# EAGLE design lp (EAGLE 7.5.0)
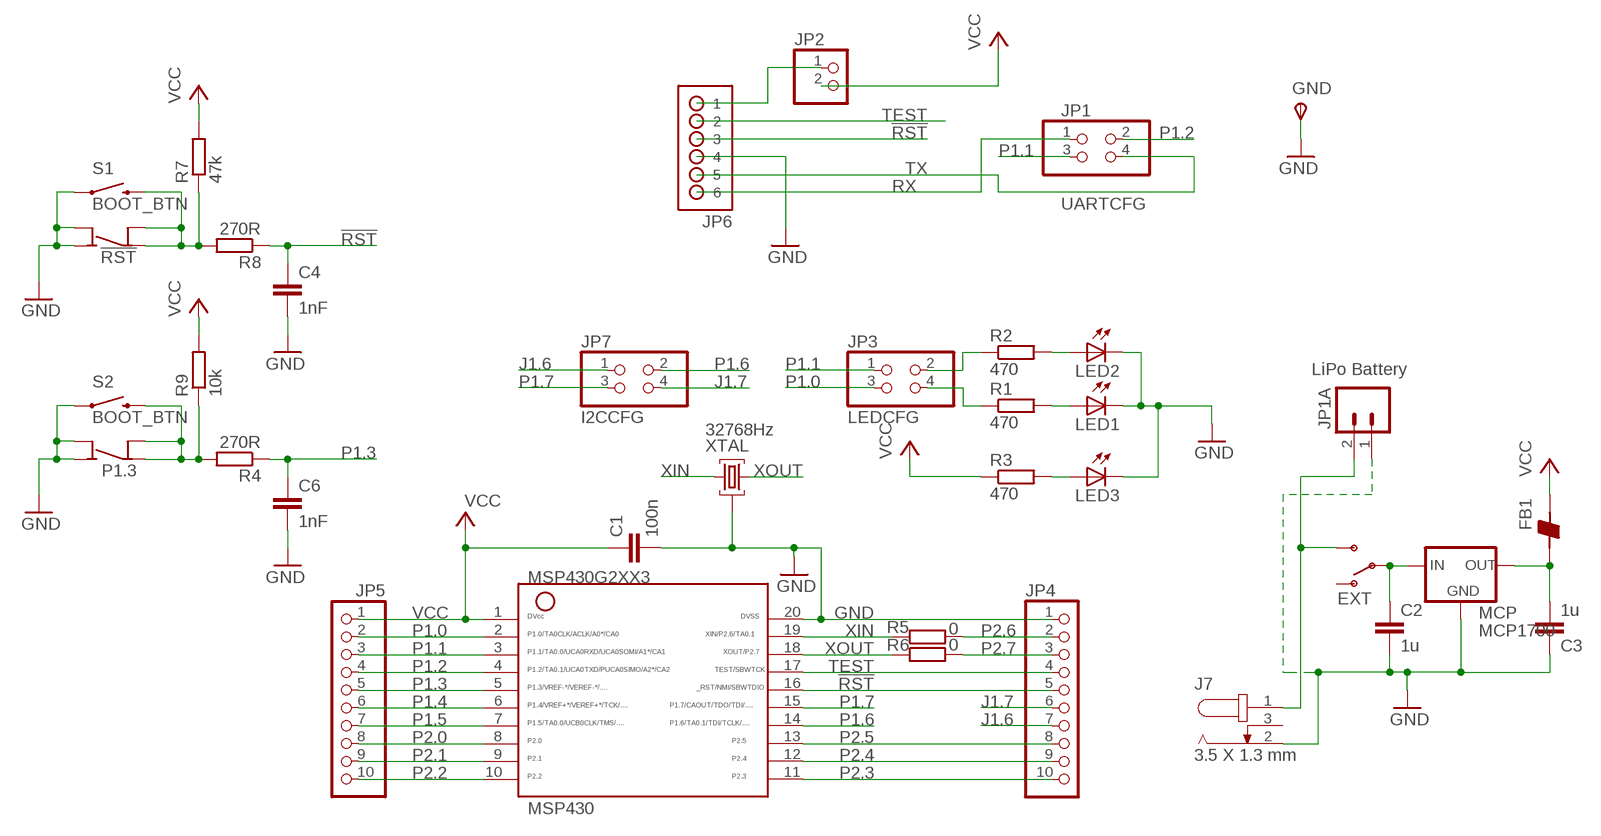
[diagram p0: schematic, sheet 1]

## Parts
!RST  !RST  SPST4  [6MMTACTILE_4PIN]
C1  100n  C-EUC0805  [C0805]
C2  1u  C-EUC0805  [C0805]
C3  1u  C-EUC0805  [C0805]
C4  1nF  C-EUC0805  [C0805]
C6  1nF  C-EUC0805  [C0805]
FB1  BEAD-0805  [0805]
GND  TPSTP20R  [TP20R]
J7  3.5 X 1.3 mm  DC_JACK_3.5X1.3MM  [3.5X1.3MM_DC_JACK]
JP1  UARTCFG  PINHD-2X2  [2X02]
JP1A  LiPo Battery  M02JST-PTH-2  [JST-2-PTH]
JP2  PINHD-1X2  [1X02]
JP3  LEDCFG  PINHD-2X2  [2X02]
JP4  PH1X10OCT076  [PH1X10OCT76]
JP5  PH1X10OCT076  [PH1X10OCT76]
JP6  No Load  HDR-1X6-OFFSET  [HDR-1X6_OFFSET]
JP7  I2CCFG  PINHD-2X2  [2X02]
LED1  0  LEDCHIPLED_1206  [CHIPLED_1206]
LED2  0  LEDCHIPLED_1206  [CHIPLED_1206]
LED3  0  LEDCHIPLED_1206  [CHIPLED_1206]
MCP  MCP1700  MCP1700SOT-23  [SOT-23]
MSP430  MSP430N  G2XX3---N20HEX  [DIP20_HEX]
ON  EXT  SWITCH-SPSTPTH  [SWITCH-SPDT]
P1.3  P1.3  SPST4  [6MMTACTILE_4PIN]
R1  470  R-EU_R0805  [R0805]
R2  470  R-EU_R0805  [R0805]
R3  470  R-EU_R0805  [R0805]
R4  270R  R-EU_R0805  [R0805]
R5  0  R-EU_R0805  [R0805]
R6  0  R-EU_R0805  [R0805]
R7  47k  R-EU_R0805  [R0805]
R8  270R  R-EU_R0805  [R0805]
R9  10k  R-EU_R0805  [R0805]
S1  BOOT_BTN  SWITCH-MOMENTARY-2-SMD-1101NE  [TACTILE-SWITCH-1101NE]
S2  BOOT_BTN  SWITCH-MOMENTARY-2-SMD-1101NE  [TACTILE-SWITCH-1101NE]
XTAL  32768Hz  QUARZ5  [QUARZ5]

## Nets
!RST: C4.1 JP4.5 JP6.3 MSP430.16 R8.1
GND [GND]: !RST.A1(NO) !RST.A2(NO) C1.2 C2.2 C3.1 C4.2 C6.2 GND.TP(PP) J7.2 JP1A.1 JP4.1 JP6.4 LED1.C LED2.C LED3.C MCP.1(GND) MSP430.20 P1.3.A1(NO) P1.3.A2(NO) S1.1 S2.1 XTAL.GND@0
J1.6: JP4.7 JP7.1
J1.7: JP4.6 JP7.4
N$1: JP3.2 R2.1
N$2: JP3.4 R1.1
N$3 [VCC]: C2.1 MCP.3(IN) ON.2(P)
N$4: P1.3.B1(COM) P1.3.B2(COM) R4.2 R9.1 S2.2
N$5: !RST.B1(COM) !RST.B2(COM) R7.1 R8.2 S1.2
N$6 [VCC]: C3.2 FB1.1 MCP.2(OUT)
N$11: LED3.A R3.2
N$13: LED1.A R1.2
N$14: LED2.A R2.2
P1.0: JP3.3 JP5.2 MSP430.2
P1.1: JP1.3 JP3.1 JP5.3 MSP430.3
P1.2: JP1.2 JP5.4 MSP430.4
P1.3: C6.1 JP5.5 MSP430.5 R4.1
P1.4: JP5.6 MSP430.6
P1.5: JP5.7 MSP430.7
P1.6: JP7.2 MSP430.14
P1.7: JP7.3 MSP430.15
P2.0: JP5.8 MSP430.8
P2.1: JP5.9 MSP430.9
P2.2: JP5.10 MSP430.10
P2.3: JP4.10 MSP430.11
P2.4: JP4.9 MSP430.12
P2.5: JP4.8 MSP430.13
P2.6: JP4.2 R5.2
P2.7: JP4.3 R6.2
RX [GND]: JP1.1 JP6.6
TEST: JP4.4 JP6.2 MSP430.17
TX [GND]: JP1.4 JP6.5
VCC [VCC]: C1.1 FB1.2 JP2.2 JP5.1 MSP430.1 R3.1 R7.2 R9.2
VCCEXT [VCC]: J7.1 JP1A.2 ON.3(S)
VCCFET [VCC]: JP2.1 JP6.1
XIN: MSP430.19 R5.1 XTAL.2
XOUT: MSP430.18 R6.1 XTAL.1
Unconnected: J7.3 ON.1(O)

## Library data of the parts
!RST P1.3 = mes_electromech:SPST4: SPST switch with 2 pins per contact
C1-C3 = rcl:C-EU: CAPACITOR, European symbol
C4 C6 = resistor:C-EU: CAPACITOR, European symbol
FB1 = CH_passive:BEAD
GND = testpad:TPS: TEST PIN
J7 = MY_CONN:DC_JACK_3.5X1.3MM
JP1 JP3 JP7 = pinhead:PINHD-2X2: PIN HEADER
JP1A = SparkFun:M02: Header 2 Standard 2-pin 0.1" header. Use with straight break away headers (SKU : PRT-00116), right angle break away headers (PRT-00553), swiss pins (PRT-00743), machine pins (PRT-00117), and female headers (PRT-00115). Molex polarized connector foot print use with SKU : PRT-08233 with associated crimp pins and housings.
JP2 = pinhead:PINHD-1X2: PIN HEADER
JP4 JP5 = MY_CONN:PH1X10
JP6 = Mechanical:HDR-1X6-OFFSET: 42 mil hole pattern with 16mil offset for jtag connector
LED1-LED3 = led:LED: LED OSRAM: - CHIPLED LG R971, LG N971, LY N971, LG Q971, LY Q971, LO R971, LY R971 LH N974, LH R974 LS Q976, LO Q976, LY Q976 LO Q996 - Hyper CHIPLED LW Q18S LB Q993, LB Q99A, LB R99A - SideLED LS A670, LO A670, LY A670, LG A670, LP A670 LB A673, LV A673, LT A673, LW A673 LH A674 LY A675 LS A676, LA A676, LO A676, LY A676, LW A676 LS A679, LY A679, LG A679 - Hyper Micro SIDELED® LS Y876, LA Y876, LO Y876, LY Y876 LT Y87S - SmartLED LW L88C, LW L88S LB L89C, LB L89S, LG L890 LS L89K, LO L89K, LY L89K LS L896, LA L896, LO L896, LY L896 - TOPLED LS T670, LO T670, LY T670, LG T670, LP T670 LSG T670, LSP T670, LSY T670, LOP T670, LYG T670 LG T671, LOG T671, LSG T671 LB T673, LV T673, LT T673, LW T673 LH T674 LS T676, LA T676, LO T676, LY T676, LB T676, LH T676, LSB T676, LW T676 LB T67C, LV T67C, LT T67C, LS T67K, LO T67K, LY T67K, LW E67C LS E67B, LA E67B, LO E67B, LY E67B, LB E67C, LV E67C, LT E67C LW T67C LS T679, LY T679, LG T679 LS T770, LO T770, LY T770, LG T770, LP T770 LB T773, LV T773, LT T773, LW T773 LH T774 LS E675, LA E675, LY E675, LS T675 LS T776, LA T776, LO T776, LY T776, LB T776 LHGB T686 LT T68C, LB T68C - Hyper Mini TOPLED® LB M676 - Mini TOPLED Santana® LG M470 LS M47K, LO M47K, LY M47K Source: http://www.osram.convergy.de LUXEON: - LUMILED® LXK2-PW12-R00, LXK2-PW12-S00, LXK2-PW14-U00, LXK2-PW14-V00 LXK2-PM12-R00, LXK2-PM12-S00, LXK2-PM14-U00 LXK2-PE12-Q00, LXK2-PE12-R00, LXK2-PE12-S00, LXK2-PE14-T00, LXK2-PE14-U00 LXK2-PB12-K00, LXK2-PB12-L00, LXK2-PB12-M00, LXK2-PB14-N00, LXK2-PB14-P00, LXK2-PB14-Q00 LXK2-PR12-L00, LXK2-PR12-M00, LXK2-PR14-Q00, LXK2-PR14-R00 LXK2-PD12-Q00, LXK2-PD12-R00, LXK2-PD12-S00 LXK2-PH12-R00, LXK2-PH12-S00 LXK2-PL12-P00, LXK2-PL12-Q00, LXK2-PL12-R00 Source: www.luxeon.com KINGBRIGHT: KA-3528ASYC Source: www.kingbright.com
MCP = MY_IC:MCP1700
MSP430 = TI_MSP430_v16:G2XX3---N20: MSP430G2XX1 PDIP (N) 20 Pin Package
ON = SparkFun:SWITCH-SPST: SPST Switch Simple slide switch. Spark Fun Electronics SKU : COM-00102
R1-R4 R7-R9 = resistor:R-EU_: RESISTOR, European symbol
R5 R6 = rcl:R-EU_: RESISTOR, European symbol
S1 S2 = SparkFun-Electromechanical:SWITCH-MOMENTARY-2: Various NO switches- pushbuttons, reed, etc
XTAL = my_xtal:QUARZ5

## Net classes
0 default: width 0.406 mm, drill 0.508 mm
1 GND: width 0.508 mm, drill 0.508 mm
2 VCC: width 1.016 mm, drill 0.508 mm
4 VCCEXT: width 0.762 mm, drill 0.508 mm, clearance 0.229 mm

## Board
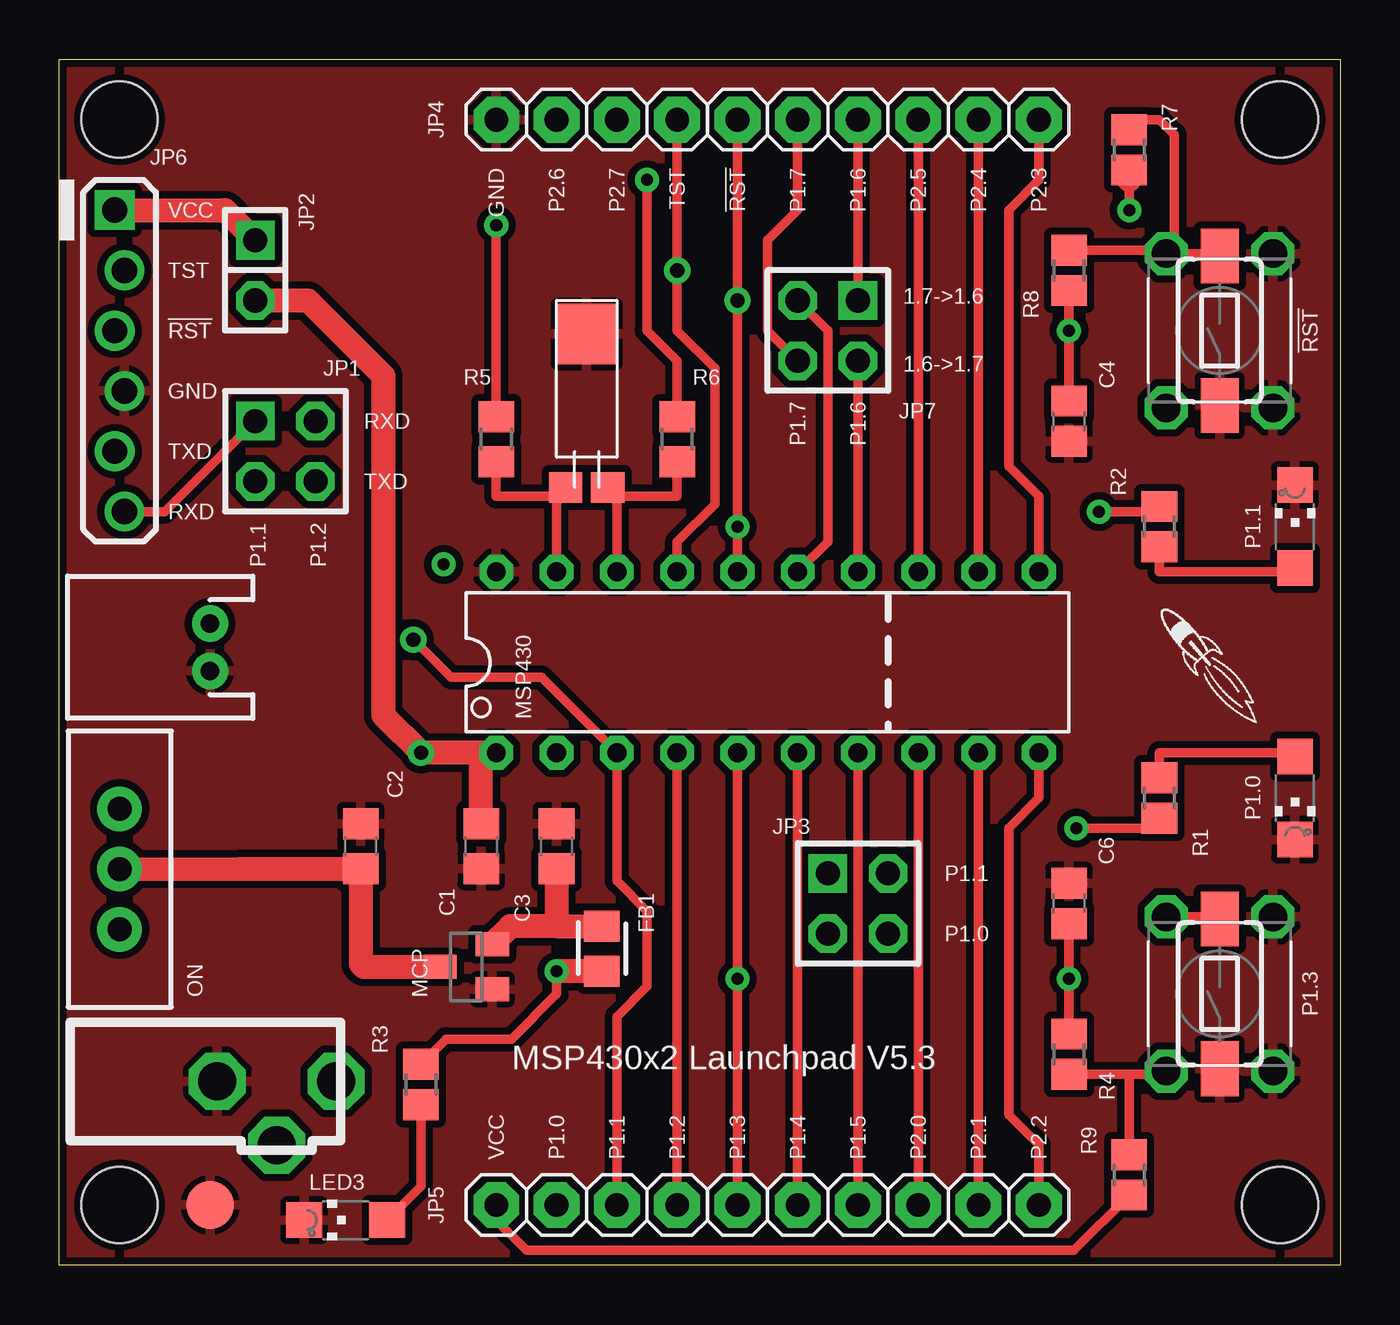
[diagram p1: board, top side]
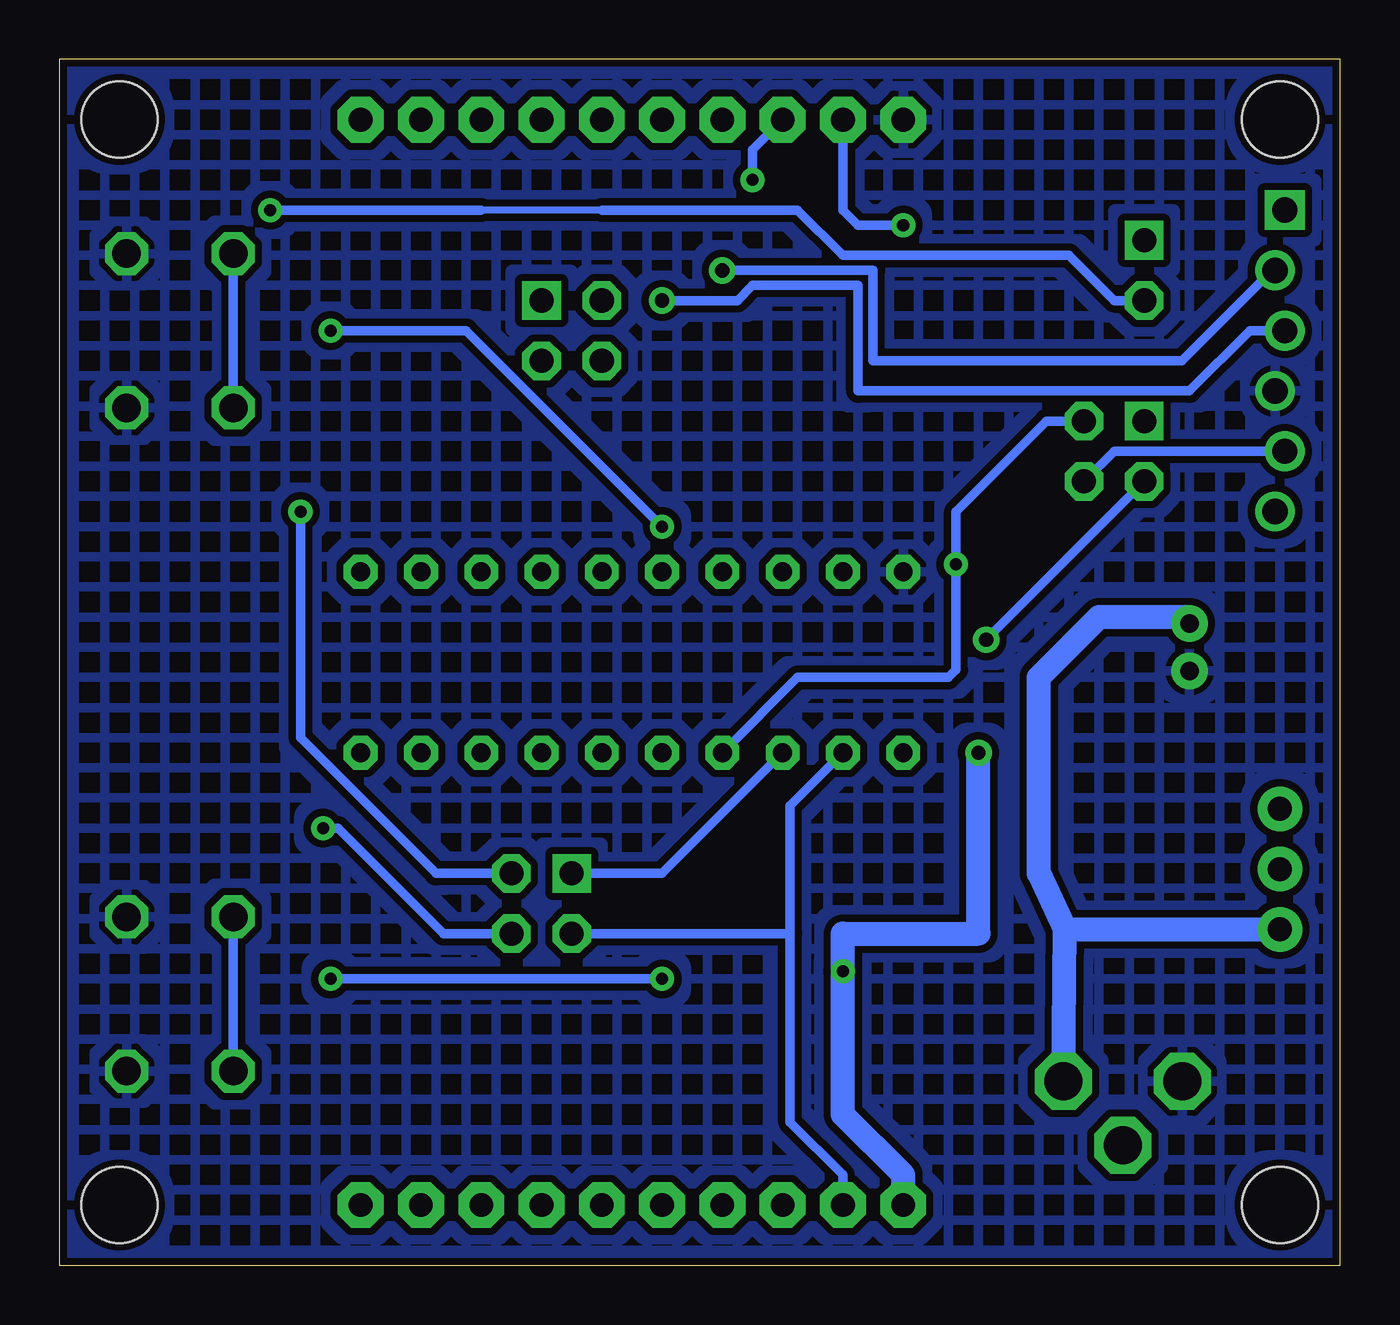
[diagram p2: board, bottom side, seen from below]

Size 53.97 x 50.8 mm. Coordinates in mm from the lower left corner, seen from the top.
Outline: 0,50.8 53.97,50.8 53.97,0 0,0 0,50.8
Copper layers (1*16): Top 0.035mm / dielectric 1.5mm / Bottom 0.035mm
Design rules "SparkFun": minimum track width 8mil, minimum drill 20mil, track to track 8mil, track to pad 8mil, pad to pad 8mil, via to via 8mil, smd to smd 8mil, copper to edge 10mil, drill to drill 8mil, minimum pad ring 12mil, minimum via ring 10mil, stop-mask expansion 4mil, vias tented up to drill 25mil, thermal gap 10mil
Holes 3.2 mm at 2.54,48.26 51.44,48.26 51.44,2.54 2.54,2.54

### Footprints (pad centres in the part's own frame; a part is rotated, then mirrored left to right if it is on the bottom)
6MMTACTILE_4PIN = drill 1.2 octagon: A1 3.25,-2.25; A2 -3.25,-2.25; B1 3.25,2.25; B2 -3.25,2.25
C0805 = smd 1.3 x 1.5: 1 -0.95,0; 2 0.95,0
C0805' = smd 1.3 x 1.5: 1 -0.85,0; 2 0.85,0
0805 = smd 1.3 x 1.5: 1 -0.95,0; 2 0.95,0
TP20R = smd 2 x 2: TP 0,0
3.5X1.3MM_DC_JACK = drill 1.6 octagon: 1 0,0; 2 -5,0; 3 -2.5,-2.7
2X02 = drill 1.016 square: 1 -1.27,-1.27 | drill 1.016 octagon: 2 -1.27,1.27; 3 1.27,-1.27; 4 1.27,1.27
JST-2-PTH = drill 0.787 pad 1.524: 1 -1,0; 2 1,0
1X02 = drill 1.016 square: 1 -1.27,0 | drill 1.016 octagon: 2 1.27,0
PH1X10OCT76 = drill 1 pad 1.93 octagon: 1 0,0; 2 2.54,0; 3 5.08,0; 4 7.62,0; 5 10.16,0; 6 12.7,0; 7 15.24,0; 8 17.78,0; 9 20.32,0; 10 22.86,0
HDR-1X6_OFFSET = drill 1.067 square: 1 -0.203,6.35 | drill 1.067: 2 0.203,3.81; 3 -0.203,1.27; 4 0.203,-1.27; 5 -0.203,-3.81; 6 0.203,-6.35
CHIPLED_1206 = smd 1.5 x 1.5: A 0,-1.75; C 0,1.75
SOT-23 = smd 1 x 1.4: 1 -0.95,-1.1; 2 0.95,-1.1; 3 0,1.1
DIP20_HEX = drill 0.8 pad 1.422 octagon: 1 -10.16,-3.81; 2 -7.62,-3.81; 3 -5.08,-3.81; 4 -2.54,-3.81; 5 0,-3.81; 6 2.54,-3.81; 7 5.08,-3.81; 8 7.62,-3.81; 9 10.16,-3.81; 10 12.7,-3.81; 11 12.7,3.81; 12 10.16,3.81; 13 7.62,3.81; 14 5.08,3.81; 15 2.54,3.81; 16 0,3.81; 17 -2.54,3.81; 18 -5.08,3.81; 19 -7.62,3.81; 20 -10.16,3.81
SWITCH-SPDT = drill 1.016 pad 1.88: 1 0,2.54; 2 0,0; 3 0,-2.54
R0805 = smd 1.3 x 1.5: 1 -0.85,0; 2 0.85,0
R0805' = smd 1.3 x 1.5: 1 -0.95,0; 2 0.95,0
TACTILE-SWITCH-1101NE = smd 2.3 x 1.6: 1 -3.15,0; 2 3.15,0
QUARZ5 = smd 1.27 x 1.397: 1 0,0.889; 2 0,-0.889 | smd 2.54 x 2.54: GND@0 -6.465,0

### Placement (x,y rotation side)
!RST  48.89,39.37 90 top
C1  17.78,17.65 270 top
C2  12.7,17.65 90 top
C3  20.96,17.65 270 top
C4  1nF  [C0805']  42.55,35.56 270 top
C6  1nF  [C0805']  42.55,15.24 90 top
FB1  22.86,13.34 270 top
GND  6.35,2.54 0 top
J7  11.66,7.75 0 top
JP1  9.52,34.29 270 top
JP1A  6.35,26.04 90 top
JP2  8.25,41.91 270 top
JP3  33.66,15.24 270 top
JP4  18.42,48.26 0 top
JP5  18.42,2.54 0 top
JP6  2.54,38.1 0 top
JP7  32.39,39.37 180 top
LED1  52.07,19.68 180 top
LED2  52.07,31.11 0 top
LED3  12.07,1.91 90 top
MCP  17.14,12.57 90 top
MSP430  28.57,25.4 0 top
ON  2.54,16.69 0 top
P1.3  48.89,11.43 90 top
R1  46.35,19.68 90 top
R2  46.35,31.11 270 top
R3  15.24,7.62 270 top
R4  42.55,8.89 270 top
R5  0  [R0805']  18.42,34.8 90 top
R6  0  [R0805']  26.04,34.8 90 top
R7  45.08,46.99 270 top
R8  42.55,41.91 90 top
R9  45.08,3.81 270 top
S1  48.89,39.37 90 top
S2  48.89,11.43 90 top
U$2  [LOGO-ROCKET]  48.26,25.4 90 top
XTAL  22.22,32.77 270 top

### Tracks (layer width: path | path; a pad name or v marks a point on that pad's centre or on a via)
!RST  (via drill 0.51, 0.6)
  Top 0.406: C4.1 v42.55,39.37 R8.1 | JP4.5 v28.57,40.64 v28.57,31.11 MSP430.16
  Bottom 0.406: v42.55,39.37 36.83,39.37 v28.57,31.11 | v28.57,40.64 25.4,40.64 24.76,41.27 20.32,41.27 20.32,36.83 6.35,36.83 3.81,39.37 JP6.3
GND
  pour Top (isolate 0.305): -0.25,-0.51 54.99,-0.51 54.99,51.31 -0.25,51.31
  pour Bottom (isolate 0.305, hatched): -0.25,-0.51 54.99,-0.51 54.99,51.31 -0.25,51.31
J1.6
  Top 0.406: JP7.1 JP4.7
J1.7
  Top 0.406: JP4.6 31.11,44.45 29.85,43.18 29.85,39.37 JP7.4
N$1  (via drill 0.51)
  Top 0.406: v43.81,31.75 46.35,31.75 R2.1
  Bottom 0.406: v43.81,31.75 43.81,22.22 38.1,16.51 JP3.2
N$2  (via drill 0.51)
  Top 0.406: v42.86,18.41 46.35,18.41 R1.1
  Bottom 0.406: JP3.4 37.78,13.97 42.23,18.41 v42.86,18.41
N$3
  Top 1.016: ON.2 7.64,16.7 C2.1 12.7,12.7 12.83,12.57 MCP.3
N$4
  Top 0.406: R9.1 45.08,8.04 | S2.2 48.8,14.68 P1.3.B1 | P1.3.B2 46.5,8.04 45.08,8.04 | 45.08,8.04 R4.2
  Bottom 0.406: P1.3.B1 P1.3.B2
N$5
  Top 0.406: R7.1 45.08,48.26 46.35,48.26 46.99,47.62 46.99,43.18 !RST.B1 | S1.2 48.8,42.62 !RST.B1 | !RST.B1 46.5,42.76 R8.2
  Bottom 0.406: !RST.B1 !RST.B2
N$6
  Top 1.016: 20.96,14.29 FB1.1 | C3.2 20.96,14.29 | 20.96,14.29 19.01,14.29 MCP.2
N$11
  Top 0.406: LED3.A 15.24,3.33 R3.2
N$13
  Top 0.406: R1.2 46.35,21.59 52.07,21.59 LED1.A
N$14
  Top 0.406: R2.2 46.35,29.21 52.07,29.21 LED2.A
P1.0
  Bottom 0.406: 23.18,13.97 JP3.3 | JP5.2 20.96,3.81 23.18,6.03 23.18,13.97 | 23.18,13.97 23.18,19.37 MSP430.2
P1.1  (via drill 0.6)
  Top 0.406: v14.92,26.35 16.51,24.76 20.32,24.76 MSP430.3 23.5,16.19 24.76,14.92 24.76,11.75 23.5,10.48 JP5.3
  Bottom 0.406: JP3.1 28.57,16.51 MSP430.3 | v14.92,26.35 JP1.3
P1.2  (via drill 0.51)
  Top 0.406: JP5.4 MSP430.4
  Bottom 0.406: MSP430.4 22.86,24.76 16.51,24.76 16.19,25.08 v16.19,29.53 16.19,31.75 12.38,35.56 JP1.2
P1.3  (via drill 0.51)
  Top 0.406: R4.1 v42.55,12.06 C6.1 | JP5.5 v28.57,12.06 MSP430.5
  Bottom 0.406: v28.57,12.06 v42.55,12.06
P1.4
  Top 0.406: JP5.6 MSP430.6
P1.5
  Top 0.406: JP5.7 MSP430.7
P1.6
  Top 0.406: MSP430.14 JP7.2
P1.7
  Top 0.406: MSP430.15 32.39,30.48 32.39,39.37 JP7.3
P2.0
  Top 0.406: JP5.8 MSP430.8
P2.1
  Top 0.406: JP5.9 MSP430.9
P2.2
  Top 0.406: MSP430.10 41.28,19.68 40,18.41 40,6.35 41.28,5.08 JP5.10
P2.3
  Top 0.406: JP4.10 41.28,45.72 40,44.45 40,33.66 41.28,32.39 MSP430.11
P2.4
  Top 0.406: MSP430.12 JP4.9
P2.5
  Top 0.406: MSP430.13 JP4.8
P2.6  (via drill 0.51)
  Top 0.406: v18.42,43.82 R5.2
  Bottom 0.406: JP4.2 20.96,44.45 20.32,43.82 v18.42,43.82
P2.7  (via drill 0.51)
  Top 0.406: R6.2 26.04,38.1 24.76,39.37 v24.76,45.72
  Bottom 0.406: v24.76,45.72 24.76,46.99 JP4.3
RX
  Top 0.406: JP6.6 4.45,31.75 JP1.1
TEST  (via drill 0.6)
  Top 0.406: JP4.4 v26.04,41.91 26.04,39.37 27.62,37.78 27.62,32.07 26.04,30.48 MSP430.17
  Bottom 0.406: v26.04,41.91 19.68,41.91 19.68,38.1 6.67,38.1 2.86,41.91 JP6.2
TX
  Bottom 0.406: JP6.5 9.52,34.29 JP1.4
VCC  (via drill 0.51, 0.6)
  Top 0.406: v45.08,44.45 45.08,45.72 | R9.2 42.76,0.64 19.68,0.64 18.42,1.91 JP5.1 | R3.1 16.29,9.53 19.05,9.53 20.96,11.43 v20.96,12.38
  Top 1.016: 45.08,45.72 R7.2 | MSP430.1 17.78,21.59 | 17.78,21.59 v15.24,21.59 13.65,23.18 13.65,37.47 10.48,40.64 JP2.2 | C1.1 17.78,21.59 | FB1.2 v20.96,12.38
  Bottom 0.305: 31.11,44.45 36.19,44.45
  Bottom 0.406: 36.19,44.45 v45.08,44.45 | 31.11,44.45 22.86,44.45 20.96,42.55 11.43,42.55 9.52,40.64 JP2.2
  Bottom 1.016: v15.24,21.59 15.24,13.97 20.96,13.97 v20.96,12.38 20.96,6.35 18.42,3.81 JP5.1
VCCEXT
  Bottom 1.016: J7.1 11.61,14.15 | 11.61,14.15 ON.3 | 11.61,14.15 12.7,16.51 12.7,24.76 10.16,27.3 6.35,27.3 JP1A.2
VCCFET
  Top 1.016: JP6.1 6.98,44.45 JP2.1
XIN
  Top 0.406: MSP430.19 20.96,32.39 | 20.96,32.39 20.96,33.02 XTAL.2 | R5.1 18.42,32.39 20.96,32.39
XOUT
  Top 0.406: MSP430.18 23.5,32.39 | 23.5,32.39 26.04,32.39 R6.1 | 23.5,32.39 XTAL.1

### Text on the board
tPlace: P1.1 | P1.1 | P1.2 | P1.0 | P1.1 | P1.0 | MSP430x2 Launchpad V5.3
tNames: GND | P2.6 | P2.7 | TST | !RST | P1.7 | P1.6 | P2.5 | P2.4 | P2.3 | VCC | TST | 1.7->1.6 | !RST | 1.6->1.7 | GND | P1.7 | P1.6 | RXD | TXD | TXD | RXD | ON | VCC | P1.0 | P1.1 | P1.2 | P1.3 | P1.4 | P1.5 | P2.0 | P2.1 | P2.2